# EAGLE design RedBoard_Turbo (EAGLE 9.1.1)
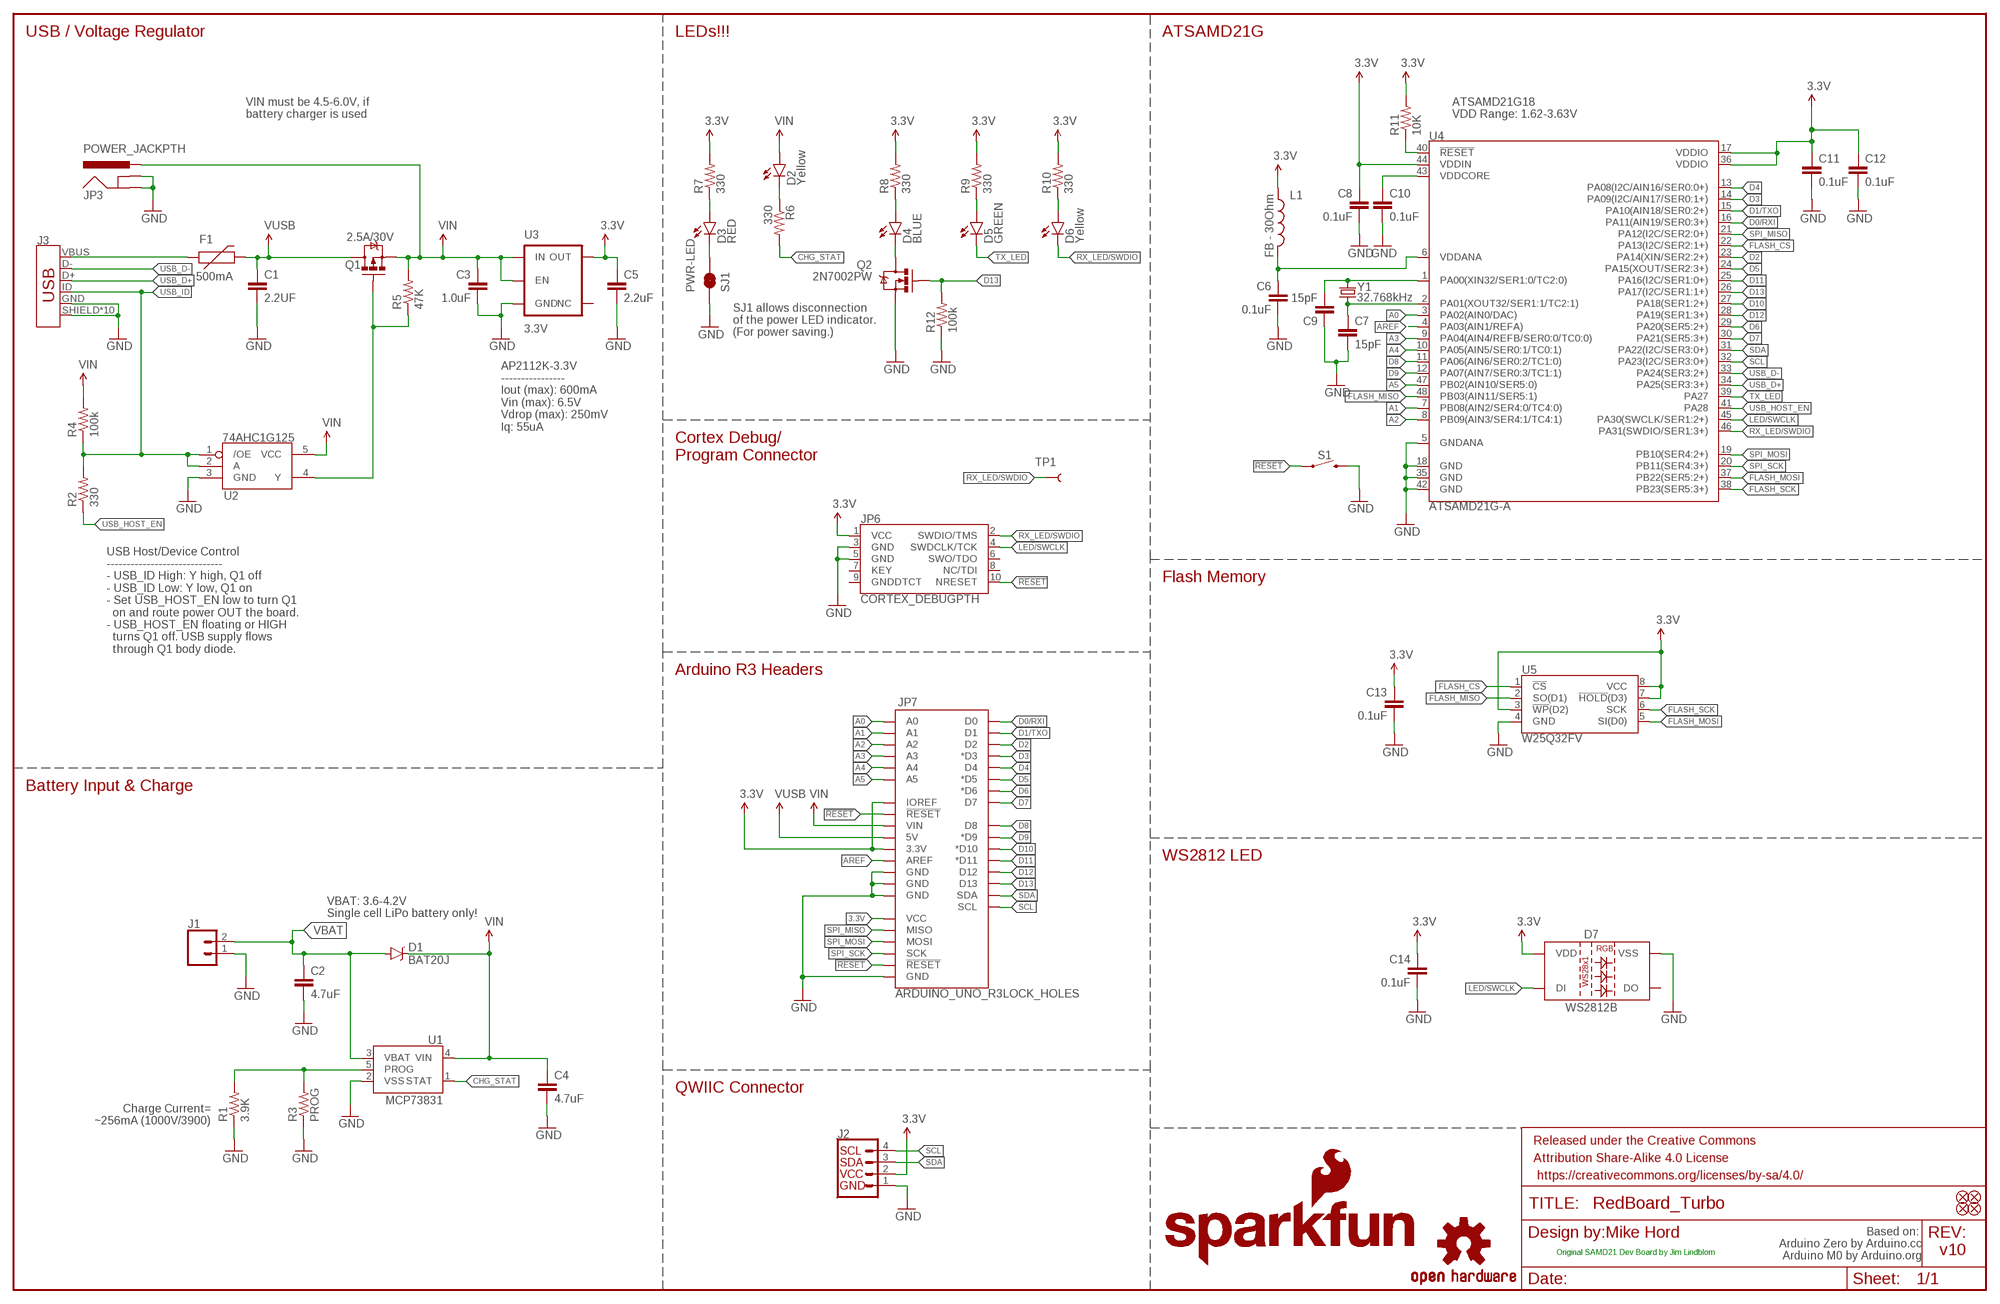
[diagram p0: schematic, sheet 1]

## Parts
C1  2.2UF  2.2UF50V10%(1206)  [1206@1]
C2  4.7uF  4.7UF-6.3V-10%(0603)0603  [0603-CAP]
C3  1.0uF  1.0UF-0805-25V-10%  [0805]
C4  4.7uF  4.7UF-6.3V-10%(0603)0603  [0603-CAP]
C5  2.2uF  2.2UF-10V-20%(0603)  [0603-CAP]
C6  0.1uF  0.1UF-25V(+80/-20%)(0603)  [0603-CAP]
C7  15pF  15PF-50V-5%(0603)  [0603-CAP]
C8  0.1uF  0.1UF-25V(+80/-20%)(0603)  [0603-CAP]
C9  15pF  15PF-50V-5%(0603)  [0603-CAP]
C10  0.1uF  0.1UF-25V(+80/-20%)(0603)  [0603-CAP]
C11  0.1uF  0.1UF-25V(+80/-20%)(0603)  [0603-CAP]
C12  0.1uF  0.1UF-25V(+80/-20%)(0603)  [0603-CAP]
C13  0.1uF  0.1UF-25V(+80/-20%)(0603)  [0603-CAP]
C14  0.1uF  0.1UF-25V(+80/-20%)(0603)  [0603-CAP]
D1  BAT20J  DIODE-SCHOTTKY-BAT20J  [SOD-323]
D2  Yellow  LED-YELLOW0603  [LED-0603]
D3  RED  LED-RED0603  [LED-0603]
D4  BLUE  LED-BLUE0603  [LED-0603]
D5  GREEN  LED-GREEN0603  [LED-0603]
D6  Yellow  LED-YELLOW0603  [LED-0603]
D7  WS2812B  [WS2812B]
F1  500mA  PTCSMD  [PTC-1206]
FID1  FIDUCIAL1X2  [FIDUCIAL-1X2]
FID2  FIDUCIAL1X2  [FIDUCIAL-1X2]
FID3  FIDUCIAL1X2  [FIDUCIAL-1X2]
FID4  FIDUCIAL1X2  [FIDUCIAL-1X2]
FRAME1  FRAME-LEDGER  [CREATIVE_COMMONS]
J1  CONN_02JST-PTH-2  [JST-2-PTH]
J2  QWIIC_CONNECTORJS-1MM  [1X04_1MM_RA]
J3  USB_MICRO-B_HALF_PTH_MILL  [USB-MICROB-PTH-MILL]
JP3  POWER_JACKPTH  [POWER_JACK_PTH]
JP6  CORTEX_DEBUGPTH  [2X5-PTH-1.27MM]
JP7  ARDUINO_UNO_R3LOCK_HOLES  [ARDUINO_R3_LOCK_HOLES]
L1  FB - 30Ohm  INDUCTOR0603  [0603]
LOGO1  SFE_LOGO_NAME_FLAME.2_INCH  [SFE_LOGO_NAME_FLAME_.2]
LOGO2  SFE_LOGO_NAME_FLAME.3_INCH  [SFE_LOGO_NAME_FLAME_.3]
LOGO3  OSHW-LOGOS  [OSHW-LOGO-S]
LOGO4  OSHW-LOGOL  [OSHW-LOGO-L]
Q1  2.5A/30V  MOSFET-PCHANNELDMG2307L  [SOT23-3]
Q2  2N7002PW  MOSFET-NCHANNEL2N7002PW  [SOT323]
R1  3.9K  3.9KOHM1/10W1%(0603)  [0603]
R2  330  330OHM1/10W1%(0603)  [0603-RES]
R3  PROG  RESISTORPTH-1/6W  [1/6W-RES]
R4  100k  100KOHM-1/10W-1%(0603)  [0603-RES]
R5  47K  47KOHM1/10W1%(0603)  [0603-RES]
R6  330  330OHM1/10W1%(0603)  [0603-RES]
R7  330  330OHM1/10W1%(0603)  [0603-RES]
R8  330  330OHM1/10W1%(0603)  [0603-RES]
R9  330  330OHM1/10W1%(0603)  [0603-RES]
R10  330  330OHM1/10W1%(0603)  [0603-RES]
R11  10K  10KOHM-1/10W-1%(0603)0603  [0603-RES]
R12  100k  100KOHM-1/10W-1%(0603)  [0603-RES]
S1  MOMENTARY-SWITCH-SPST-SMD-5.2-TALL-REDUNDANT  [TACTILE_SWITCH_SMD_5.2MM]
SJ1  PWR-LED  JUMPER-PAD-2-NC_BY_TRACENO_SILK  [PAD-JUMPER-2-NC_BY_TRACE_NO_SILK]
TP1  TEST-POINTTP_15TH_THRU  [TP_15TH]
U1  MCP73831  [SOT23-5]
U2  74AHC1G125  [SOT23-5]
U3  3.3V  V_REG_AP2112K-3.3V  [SOT23-5]
U4  ATSAMD21G-A  [TQFP-48]
U5  W25Q32FV  W25Q32FVSS  [SOIC-8]
Y1  32.768kHz  CRYSTAL3.2X1.5MM  [CRYSTAL-SMD-3.2X1.5MM]

## Nets
3.3V: C5.1 C8.1 C11.1 C12.1 C13.1 C14.1 D7.1(VDD) J2.2 JP6.1(VCC) JP7.3.3V JP7.IOREF JP7.VCC L1.1 R7.2 R8.2 R9.2 R10.2 R11.2 U3.5(OUT) U4.17(VDDIO) U4.36(VDDIO) U4.44(VDDIN) U5.3(!WP!(D2)) U5.7(!HOLD!(D3)) U5.8(VCC)
!RESET: JP6.10(NRESET) JP7.RESET@1(!RESET!) JP7.RESET@2(!RESET!) R11.1 S1.1 S1.2 U4.40(!RESET!)
A0: JP7.A0 U4.3(PA02(AIN0/DAC))
A1: JP7.A1 U4.7(PB08(AIN2/SER4:0/TC4:0))
A2: JP7.A2 U4.8(PB09(AIN3/SER4:1/TC4:1))
A3: JP7.A3 U4.9(PA04(AIN4/REFB/SER0:0/TC0:0))
A4: JP7.A4 U4.10(PA05(AIN5/SER0:1/TC0:1))
A5: JP7.A5 U4.47(PB02(AIN10/SER5:0))
AREF: JP7.AREF U4.4(PA03(AIN1/REFA))
CHG_STAT: R6.2 U1.1(STAT)
D0/RXI: JP7.D0 U4.16(PA11(AIN19/SER0:3+))
D1/TXO: JP7.D1 U4.15(PA10(AIN18/SER0:2+))
D2: JP7.D2 U4.23(PA14(XIN/SER2:2+))
D3: JP7.D3(*D3) U4.14(PA09(I2C/AIN17/SER0:1+))
D4: JP7.D4 U4.13(PA08(I2C/AIN16/SER0:0+))
D5: JP7.D5(*D5) U4.24(PA15(XOUT/SER2:3+))
D6: JP7.D6(*D6) U4.29(PA20(SER5:2+))
D7: JP7.D7 U4.30(PA21(SER5:3+))
D8: JP7.D8 U4.11(PA06(AIN6/SER0:2/TC1:0))
D9: JP7.D9(*D9) U4.12(PA07(AIN7/SER0:3/TC1:1))
D10: JP7.D10(*D10) U4.27(PA18(SER1:2+))
D11: JP7.D11(*D11) U4.25(PA16(I2C/SER1:0+))
D12: JP7.D12 U4.28(PA19(SER1:3+))
D13: JP7.D13 Q2.1(G) R12.2 U4.26(PA17(I2C/SER1:1+))
FLASH_CS: U4.22(PA13(I2C/SER2:1+)) U5.1(!CS!)
FLASH_MISO: U4.48(PB03(AIN11/SER5:1)) U5.2(SO(D1))
FLASH_MOSI: U4.37(PB22(SER5:2+)) U5.5(SI(D0))
FLASH_SCK: U4.38(PB23(SER5:3+)) U5.6(SCK)
GND: C1.2 C2.2 C3.2 C4.2 C5.2 C6.2 C7.2 C8.2 C9.1 C10.2 C11.2 C12.2 C13.2 C14.2 D7.3(VSS) J1.1 J2.1 J3.GND J3.SHIELD J3.SHIELD2(SHIELD) J3.SHIELD3(SHIELD) J3.SHIELD4(SHIELD) J3.SHIELD5(SHIELD) J3.SHIELD6(SHIELD) J3.SHIELD7(SHIELD) J3.SHIELD8(SHIELD) J3.SHIELD9(SHIELD) J3.SHIELD10(SHIELD) JP3.GND JP3.GNDBREAK JP6.3(GND) JP6.5(GND) JP7.GND@1(GND) JP7.GND@2(GND) JP7.GND@3(GND) JP7.GND@4(GND) Q2.2(S) R1.1 R3.1 R12.1 S1.3 S1.4 SJ1.1 U1.2(VSS) U2.3(GND) U3.2(GND) U4.5(GNDANA) U4.18(GND) U4.35(GND) U4.42(GND) U5.4(GND)
LED/SWCLK: D7.4(DI) JP6.4(SWDCLK/TCK) U4.45(PA30(SWCLK/SER1:2+))
N$1: F1.1 J3.VBUS
N$2: C9.2 U4.1(PA00(XIN32/SER1:0/TC2:0)) Y1.P$2
N$3: D4.C Q2.3(D)
N$4: C7.1 U4.2(PA01(XOUT32/SER1:1/TC2:1)) Y1.P$1
N$5: D3.A R7.1
N$6: D4.A R8.1
N$8: D2.C R6.1
N$10: D5.A R9.1
N$11: D6.A R10.1
N$12: D3.C SJ1.2
N$13: R1.2 R3.2 U1.5(PROG)
RX_LED/SWDIO: D6.C JP6.2(SWDIO/TMS) TP1.P$1 U4.46(PA31(SWDIO/SER1:3+))
SCL: J2.4 JP7.SCL U4.32(PA23(I2C/SER3:0+))
SDA: J2.3 JP7.SDA U4.31(PA22(I2C/SER3:0+))
SPI_MISO: JP7.MISO U4.21(PA12(I2C/SER2:0+))
SPI_MOSI: JP7.MOSI U4.19(PB10(SER4:2+))
SPI_SCK: JP7.SCK U4.20(PB11(SER4:3+))
TX_LED: D5.C U4.39(PA27)
USB_D+: J3.D+ U4.34(PA25(SER3:3+))
USB_D-: J3.D- U4.33(PA24(SER3:2+))
USB_HOST_EN: R2.1 U4.41(PA28)
USB_HOST_POWER_EN: Q1.1(G) R5.1 U2.4(Y)
USB_ID: J3.ID R2.2 R4.1 U2.1(/OE) U2.2(A)
VBAT: C2.1 D1.A J1.2 U1.3(VBAT)
VDDANA: C6.1 L1.2 U4.6(VDDANA)
VDDCORE: C10.1 U4.43(VDDCORE)
VIN: C3.1 C4.1 D1.C D2.A JP3.PWR JP7.VIN Q1.2(S) R4.2 R5.2 U1.4(VIN) U2.5(VCC) U3.1(IN) U3.3(EN)
VUSB: C1.1 F1.2 JP7.5V Q1.3(D)
Unconnected: D7.2(DO) JP6.6(SWO/TDO) JP6.7(KEY) JP6.8(NC/TDI) JP6.9(GNDDTCT) U3.4(NC)

## Notes on the sheet
- USB / Voltage Regulator | LEDs!!! | ATSAMD21G
- VIN must be 4.5-6.0V, if 
  battery charger is used
- ATSAMD21G18
  VDD Range: 1.62-3.63V
- SJ1 allows disconnection
  of the power LED indicator.
  (For power saving.)
- AP2112K-3.3V
  ----------------
  Iout (max): 600mA 
  Vin (max): 6.5V
  Vdrop (max): 250mV
  Iq: 55uA
- Cortex Debug/
  Program Connector
- USB Host/Device Control
  -----------------------------
  - USB_ID High: Y high, Q1 off
  - USB_ID Low: Y low, Q1 on
  - Set USB_HOST_EN low to turn Q1
    on and route power OUT the board.
  - USB_HOST_EN floating or HIGH
    turns Q1 off. USB supply flows
    through Q1 body diode.
- Flash Memory
- Arduino R3 Headers
- Battery Input & Charge
- WS2812 LED
- VBAT: 3.6-4.2V
  Single cell LiPo battery only\!
- QWIIC Connector
- Charge Current=
  ~256mA (1000V/3900)
- Mike Hord
- Based on: 
  Arduino Zero by Arduino.cc
  Arduino M0 by Arduino.org
- v10
- Original SAMD21 Dev Board by Jim Lindblom

## Library data of the parts
C1 = SparkFun-Capacitors:2.2UF50V10%(1206): CAP-10009; PROD_ID: CAP-10009
C2 C4 = SparkFun-Capacitors:4.7UF-6.3V-10%(0603): CAP-08280; PROD_ID: CAP-08280
C3 = SparkFun-Capacitors:1.0UF: 1µF ceramic capacitors A capacitor is a passive two-terminal electrical component used to store electrical energy temporarily in an electric field.; PROD_ID: CAP-08064
C5 = SparkFun-Capacitors:2.2UF-10V-20%(0603): CAP-07888; PROD_ID: CAP-07888
C6 C8 C10-C14 = SparkFun-Capacitors:0.1UF-25V(+80/-20%)(0603): CAP-00810 Ceramic Standard decoupling cap; PROD_ID: CAP-00810
C7 C9 = SparkFun-Capacitors:15PF-50V-5%(0603): CAP-07881; PROD_ID: CAP-07881
D1 = SparkFun-DiscreteSemi:DIODE-SCHOTTKY: Schottky diodes in SFE's production catalog BAT20J 1A 23V 0.62Vf RB751 120mA 40V 0.37Vf PMEG4005EJ 0.5A 40V 0.42Vf MBRA140 1A 40V 0.5Vf B340A 3A 40V SMA; PROD_ID: DIO-11623
D2 D6 = SparkFun-LED:LED-YELLOW: Yellow SMD LED Used in manufacturing several products at SparkFun. Packages: 0603 - SMD 0603 package[Product Link] <http://www.kingbrightusa.com/product.asp?catalog_name=LED&product_id=APT1608SYCK> 0603 -SMART - SMART SMD 0603 package (more efficient/more expensive) [Product Link] <http://www.osram-os.com/osram_os/en/products/product-catalog/led-light-emitting-diodes/smartled-0603/ly-l29k/index.jsp> LilyPad - SMD1206 package[Product Datasheet] <https://www.sparkfun.com/datasheets/DevTools/LilyPad/Q150YUS4.pdf> SparkFun Products: Blynk Board <https://www.sparkfun.com/products/13794> IOIO-OTG <https://www.sparkfun.com/products/13613> XBee Explorer Serial <https://www.sparkfun.com/products/13225>; PROD_ID: DIO-09003
D3 = SparkFun-LED:LED-RED: Red SMD LED Used in manufacturing of most products at SparkFun Packages: 0603 - SMD 0603 package [Product Link] <http://docs.avagotech.com/docs/AV02-0551EN> 0603 SMART - SMD 0603 SMART package ( more efficient and expensive)[Product Link] <http://www.osram-os.com/Graphics/XPic2/00077099_0.pdf> 1206 - SMD1206 package [Product Link] <https://www.sparkfun.com/datasheets/DevTools/LilyPad/Q150OVS4.pdff> SparkFun Products: Pro Mini 328 -5V <https://www.sparkfun.com/products/821> RedBoard <https://www.sparkfun.com/products/12757> IOIO-OTG <https://www.sparkfun.com/products/13613>; PROD_ID: DIO-00819
D4 = SparkFun-LED:LED-BLUE: Blue SMD LED Used in manufacturing of various products at SparkFun Packages: 0603 - SMD 0603 package [Product Link] <http://www.digikey.com/product-detail/en/SMLE12BC7TT86/511-1589-2-ND/1641808> 1206 - SMD1206 package [Product Link] <http://www.digikey.com/product-detail/en/lite-on-inc/LTST-C150TBKT/160-1643-1-ND/573584> SparkFun Products: ESP8266 Thing-Dev Board <https://www.sparkfun.com/products/13711> RedBoard <https://www.sparkfun.com/products/12757>; PROD_ID: DIO-08575
D5 = SparkFun-LED:LED-GREEN: Green SMD LED Used in manufacturing of various products at SparkFun Packages: 0603 - SMD 0603 package [Product Link] <http://www.futureelectronics.com/en/technologies/semiconductors/optoelectronics/leds/Pages/9894312-LTST-C190GKT.aspx?CrossPart=HSMG-C190&IM=0> LilyPad 1206 - SMD1206 LilyPad package [Product Link] <http://www.futureelectronics.com/en/Technologies/Product.aspx?ProductID=IN150NGHARVATEKCORPORATION2049943&IM=0> 1206 - SMD1206 package [Product Link] <http://www.futureelectronics.com/en/technologies/semiconductors/optoelectronics/leds/Pages/8315665-LTST-C150KGKT.aspx?IM=0> 1206 Bottom Mount -SMD 1206 Bottom Mount [Product Link] <http://www.digikey.com/product-detail/en/lite-on-inc/LTST-C230KGKT/160-1456-1-ND/386854> SparkFun Products: Pro Mini 328 -5V <https://www.sparkfun.com/products/821> RedBoard <https://www.sparkfun.com/products/12757> MP3 Trigger <https://www.sparkfun.com/products/13720> Makey Makey <https://www.sparkfun.com/products/11076>; PROD_ID: DIO-00821
D7 = SparkFun-LED:WS2812B: WS2812B SMD addressable RGB LED 5x5mm SMD LED with built-in controller IC. Color: Red/Green/Blue mC Rating: RGB: 390, 660, 180 mcd Forward Voltage: RGB: 2.0, 3.0, 3.0 V Packages:WS2812B SparkFun Products: Blynk Board - ESP8266 <https://www.sparkfun.com/products/13794>; PROD_ID: DIO-12503
F1 = SparkFun-PowerIC:PTC: Resettable Fuse PTC Resettable Fuse. Spark Fun Electronics SKU : COM-08357; PROD_ID: RES-11150
FID1-FID4 = SparkFun-Aesthetics:FIDUCIAL: Fiducial Alignment Points Various fiducial points for machine vision alignment.
FRAME1 = SparkFun-Aesthetics:FRAME-LEDGER: Schematic Frame Standard 11x14 US Ledger frame
J1 = SparkFun-Connectors:CONN_02: Multi connection point. Often used as Generic Header-pin footprint for 0.1 inch spaced/style header connections On any of the 0.1 inch spaced packages, you can populate with these: Break Away Headers - Straight <https://www.sparkfun.com/products/116> (PRT-00116) Break Away Male Headers - Right Angle <https://www.sparkfun.com/products/553> (PRT-00553) Female Headers <https://www.sparkfun.com/products/115> (PRT-00115) Break Away Headers - Machine Pin <https://www.sparkfun.com/products/117> (PRT-00117) Break Away Female Headers - Swiss Machine Pin <https://www.sparkfun.com/products/743> (PRT-00743) For SCREWTERMINALS and SPRING TERMINALS visit here: Screw Terimnals on SparkFun.com <https://www.sparkfun.com/search/results?term=Screw+Terminals> (5mm/3.5mm/2.54mm spacing) This device is also useful as a general connection point to wire up your design to another part of your project. Our various solder wires solder well into these plated through hole pads. Hook-Up Wire - Assortment (Stranded, 22 AWG) <https://www.sparkfun.com/products/11375> (PRT-11375) Hook-Up Wire - Assortment (Solid Core, 22 AWG) <https://www.sparkfun.com/products/11367> (PRT-11367) View the entire wire category on our website here <https://www.sparkfun.com/categories/141> Special notes: Molex polarized connector foot print use with: PRT-08233 with associated crimp pins and housings. 2.54_SCREWTERM for use with PRT-10571. 3.5mm Screw Terminal footprints for PRT-08084 5mm Screw Terminal footprints for use with PRT-08432; PROD_ID: CONN-09863; SKU: PRT-09914
J2 = SparkFun-Connectors:QWIIC_CONNECTOR: SparkFun I2C Standard Qwiic Connector An SMD 1mm pitch JST connector makes it easy and quick (get it? Qwiic?) to connect I2C devices to each other. The Qwiic system <http://www.sparkfun.com/qwiic> enables fast and solderless connection between popular platforms and various sensors and actuators. We carry 200mm <https://www.sparkfun.com/products/14204>, 100mm <https://www.sparkfun.com/products/14205>, 50mm <https://www.sparkfun.com/products/14206>, and breadboard friendly <https://www.sparkfun.com/products/14207> Qwiic cables. We also offer 10 pcs strips <https://www.sparkfun.com/products/14323> the SMD connectors.; PROD_ID: CONN-13694
J3 = SparkFun-Connectors:USB_MICRO-B: USB Type Micro-B Connector Male/female and PTH/SMT variants SparkFun Products: SparkFun microB USB Breakout <https://www.sparkfun.com/products/12035> SparkFun USB microB Plug Breakout <https://www.sparkfun.com/products/10031> SparkFun ESP8266 Thing <https://www.sparkfun.com/products/13231>; PROD_ID: CONN-13711
JP3 = SparkFun-Connectors:POWER_JACK: Power Jack This is the standard 5.5mm barrel jack for power. The PTH is the most common, proven, reliable, footprint. The Slot footprint only works if the mill layer is transmitted to the PCB fab house so be warned. Mating wall wart : TOL-00298 (and others); PROD_ID: CONN-08197
JP6 = samd21-temp:CORTEX_DEBUG: Cortex Debug Connector Datasheet <http://infocenter.arm.com/help/topic/com.arm.doc.faqs/attached/13634/cortex_debug_connectors.pdf>
JP7 = SparkFun-Boards:ARDUINO_UNO_R3: Arduino R3 Footprint with SPI header Arduino Uno R3 Compatible Footprint. Matches PCB size of the original board. SparkFun Products: SAMD21 Dev Breakout <https://www.sparkfun.com/products/13672> RedBoard <https://www.sparkfun.com/products/12757> R3 Stackable Headers <https://www.sparkfun.com/products/11417>
L1 = SparkFun-Passives:INDUCTOR: Inductors Basic Inductor/Choke - 0603 and 1206. Footprints are not proven and vary greatly between part numbers. INDUCTOR POWER 3.3UH 4.0A SMD 0.197" L x 0.197" W x 0.177" H (5.00mm x 5.00mm x 4.50mm); PROD_ID: NDUC-07859
LOGO1 LOGO2 = SparkFun-Aesthetics:SFE_LOGO_NAME_FLAME: SparkFun Font Logo w/ Flame This is the SparkFun full logo. The logo on the schematic will always be the same size; the package variant is the height of the flame part of the logo. Default layer for the logo on the board is tSilk.
LOGO3 LOGO4 = SparkFun-Aesthetics:OSHW-LOGO: Open Source Hardware Logo This logo indicates the piece of hardware it is found on incorporates a OSHW license and/or adheres to the definition of open source hardware found here: http://freedomdefined.org/OSHW
Q1 = SparkFun-DiscreteSemi:MOSFET-PCHANNEL: Generic PMOSFET IRLML2244 - TRANS-11153 (SOT-23 -20V -4.3A) (1.Gate 2.Source 3.Drain) FQP27P06 - COM-10349 <http://www.sparkfun.com/products/10349> (TO-220 -60V -27A) (1.Gate 2.Source 3.Drain); PROD_ID: TRANS-11308
Q2 = SparkFun-DiscreteSemi:MOSFET-NCHANNEL: Common NMOSFET Parts MFG P/N Store ID Prod ID FDD8780 TRANS-09984 SI7820DN TRANS-11055 FDS6630A IC-08089 2N7002PW TRANS-11151 FQP30N06L COM-10213 TRANS-10060 BSS123LT1G TRANS-08345 BSS138 TRANS-00830 BS170 2N7000; PROD_ID: TRANS-11151
R1 = SparkFun-Resistors:3.9KOHM1/10W1%(0603): RES-08701; PROD_ID: RES-08701
R2 R6-R10 = SparkFun-Resistors:330OHM1/10W1%(0603): RES-00818; PROD_ID: RES-00818
R3 = SparkFun-Passives:RESISTOR: Resistor Basic schematic elements and footprints for 0603, 1206, and PTH resistors.
R4 R12 = SparkFun-Resistors:100KOHM-1/10W-1%(0603): RES-07828; PROD_ID: RES-07828
R5 = SparkFun-Resistors:47KOHM1/10W1%(0603): RES-07871; PROD_ID: RES-07871
R11 = SparkFun-Resistors:10KOHM-1/10W-1%(0603): RES-00824; PROD_ID: RES-00824
S1 = SparkFun-Switches:MOMENTARY-SWITCH-SPST: Momentary Switch (Pushbutton) - SPST Normally-open (NO) SPST momentary switches (buttons, pushbuttons). Variants PTH-12MM - 12mm square, through-hole Momentary Pushbutton Switch - 12mm Square <https://www.sparkfun.com/products/9190> (COM-09190) PTH-6.0MM, PTH-6.0MM-KIT - 6.0mm square, through-hole Mini Pushbutton Switch <https://www.sparkfun.com/products/97> (COM-00097) KIT package intended for soldering kit's - only one side of pads' copper is exposed. PTH-RIGHT-ANGLE-KIT - Right-angle, through-hole Right Angle Tactile Button <https://www.sparkfun.com/products/10791> - Used on SparkFun BigTime Watch Kit <https://www.sparkfun.com/products/11734> SMD-12MM - 12mm square, surface-mount Tactile Button - SMD (12mm) <https://www.sparkfun.com/products/12993> (COM-12993) Used on SparkFun PicoBoard <https://www.sparkfun.com/products/11888> SMD-4.5MM - 4.5mm Square Trackball Switch Used on SparkFun Blackberry Trackballer Breakout <https://www.sparkfun.com/products/13169> SMD-4.6MMX2.8MM - 4.60mm x 2.80mm, surface mount Used on SparkFun SAMD21 Mini Breakout <https://www.sparkfun.com/products/13664> SMD-5.2MM, SMD-5.2-REDUNDANT - 5.2mm square, surface-mount Mini Pushbutton Switch - SMD <https://www.sparkfun.com/products/8720> (COM-08720) Used on Arduino Pro Mini <https://www.sparkfun.com/products/11114> REDUNDANT package connects both switch circuits together SMD-6.0X3.5MM - 6.0 x 3.5mm, surface mount Momentary Reset Switch SMD <https://www.sparkfun.com/products/8229> (COM-08229) SMD-6.2MM-TALL - 6.2mm square, surface mount Tactile Button - SMD (6mm) <https://www.sparkfun.com/products/12992> Used on SparkFun Digital Sandbox <https://www.sparkfun.com/products/12651> SMD-RIGHT-ANGLE - Right-angle, surface mount Used on SparkFun Block for Intel® Edison - Arduino <https://www.sparkfun.com/products/13036>; PROD_ID: SWCH-14139
SJ1 = SparkFun-Passives:JUMPER-PAD-2-NC_BY_TRACE
TP1 = SparkFun-Connectors:TEST-POINT: SparkFun Test Points Bare copper test points for troubleshooting or In-Circuit-Testing. These are used by our Production team for verifying production board runs using pogo-pins on test beds. SparkFun Products: SparkFun LSM9DS1 Breakout <https://www.sparkfun.com/products/13284> SparkFun PSOC <https://www.sparkfun.com/products/13714> SparkFun Load Cell Amplifier <https://www.sparkfun.com/products/13879>
U1 = SparkFun-PowerIC:MCP73831: Miniature single cell, fully integrated Li-Ion, Li-polymer charge management controller http://ww1.microchip.com/downloads/en/DeviceDoc/20001984g.pdf IC-09995; PROD_ID: IC-09995
U2 = SparkFun-DigitalIC:74AHC1G125: Single bus buffer gate with 3-state output; PROD_ID: IC-11920
U3 = SparkFun-PowerIC:V_REG_AP2112: AP2112 - 600mA CMOS LDO Regulator w/ Enable The AP2112 is CMOS process low dropout linear regulator with enable function, the regulator delivers a guaranteed 600mA (min.) continuous load current. Features Output Voltage Accuracy: ±1.5% Output Current: 600mA (Min.) Foldback Short Current Protection: 50mA Enable Function to Turn ON/OFF VOUT Low Dropout Voltage (3.3V): 250mV (Typ.) @IOUT=600mA Excellent Load Regulation: 0.2%/A (Typ.) Excellent Line Regulation: 0.02%/V (Typ.) Low Quiescent Current: 55μA (Typ.) Low Standby Current: 0.01μA (Typ.) Low Output Noise: 50μVRMS PSRR: 100Hz -65dB, 1kHz -65dB OTSD Protection Stable with 1.0μF Flexible Cap: Ceramic, Tantalum and Aluminum Electrolytic Operation Temperature Range: -40°C to 85°C ESD: MM 400V, HBM 4000V; PROD_ID: VREG-12457
U4 = samd21-temp:ATSAMD21G: Atmel SAMD21G SMART ARM-Based Microcontroller The Atmel ® | SMART ™ SAM D21 is a series of low-power microcontrollers using the 32-bit ARM ® Cortex ® -M0+ processor, and ranging from 32- to 64-pins with up to 256KB Flash and 32KB of SRAM. The SAM D21 devices operate at a maximum frequency of 48MHz and reach 2.46 CoreMark/MHz. They are designed for simple and intuitive migration with identical peripheral modules, hex compatible code, identical linear address map and pin compatible migration paths between all devices in the product series. All devices include intelligent and flexible peripherals, Atmel Event System for inter-peripheral signaling, and support for capacitive touch button, slider and wheel user interfaces.; PROD_ID: IC-13064
U5 = SparkFun-IC-Memory:W25Q32FV: W25Q32FV 32Mb (4MB) Serial Flash Memory The W25Q32FV support the standard Serial Peripheral Interface (SPI), Dual/Quad I/O SPI as well as 2-clocks instruction cycle Quad Peripheral Interface (QPI). 104MHz, SPI, 8-SOIC-EIAJ Datasheet <http://www.winbond.com/resource-files/w25q32fv%20revh%20091613.pdf> SparkFun Products SparkFun Blynk Board - ESP8266 <https://www.sparkfun.com/products/13794> (WRL-13794); PROD_ID: IC-13229
Y1 = samd21-temp:CRYSTAL: Various standard crystals. Proven footprints.; PROD_ID: XTAL-13062

## Board
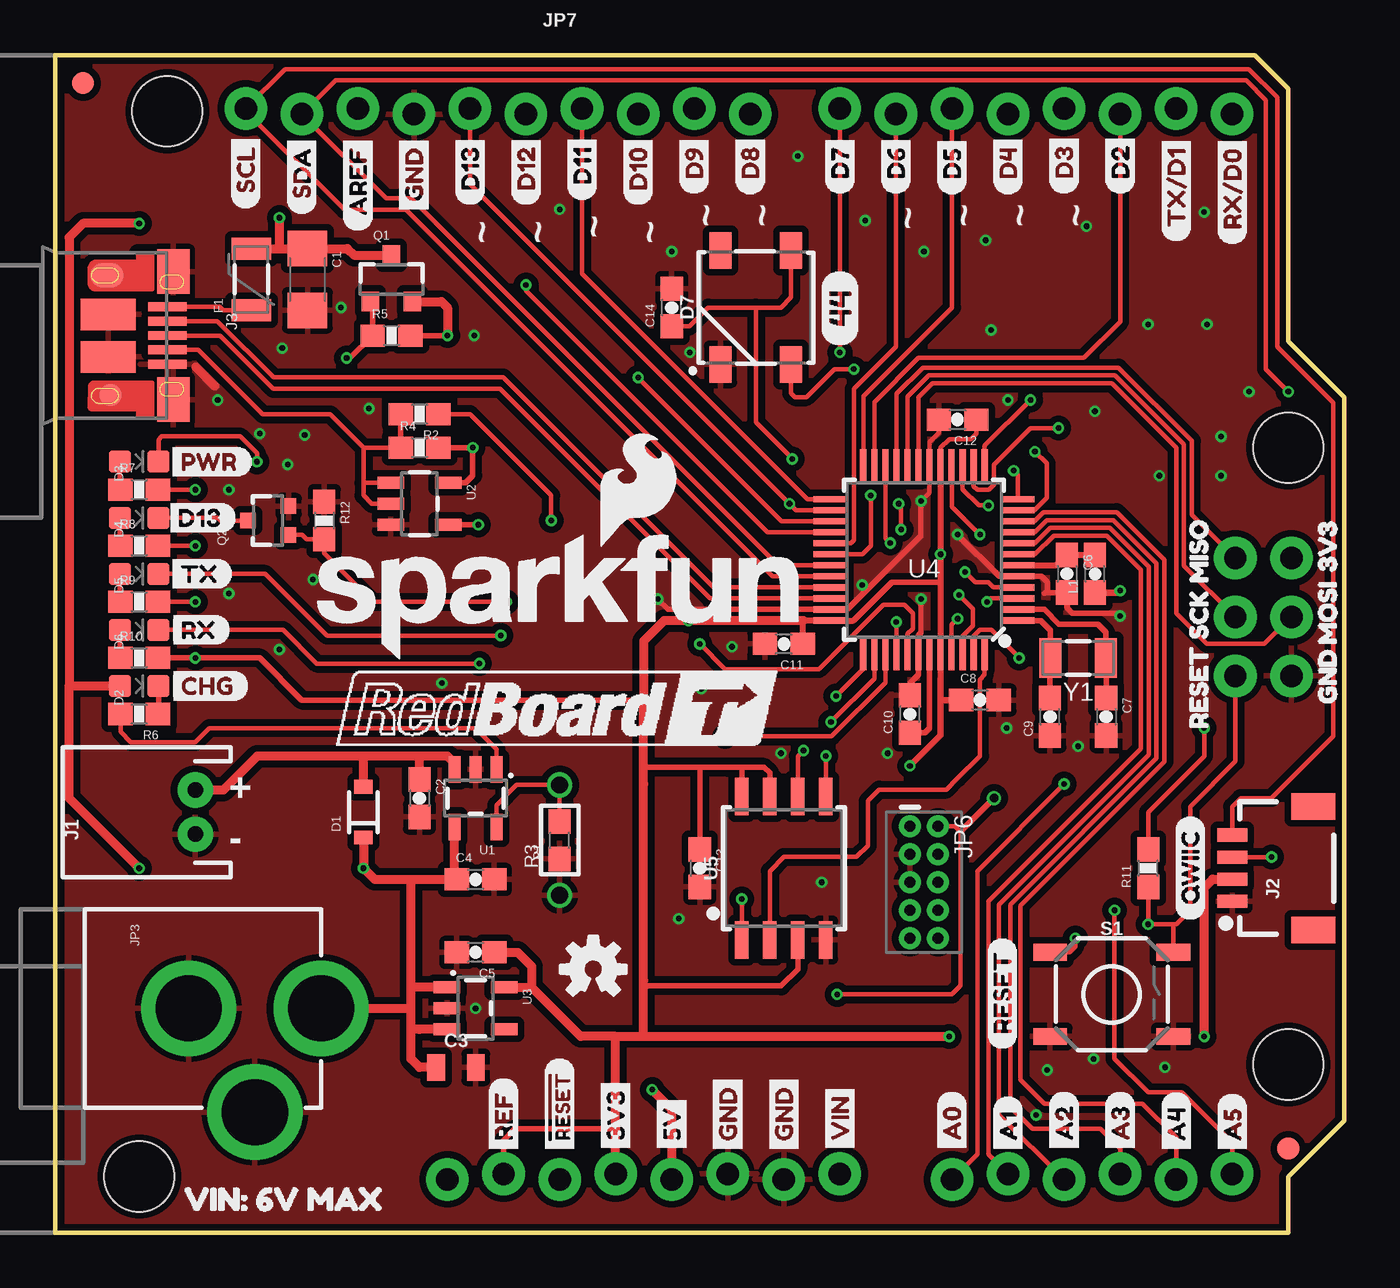
[diagram p1: board, top side]
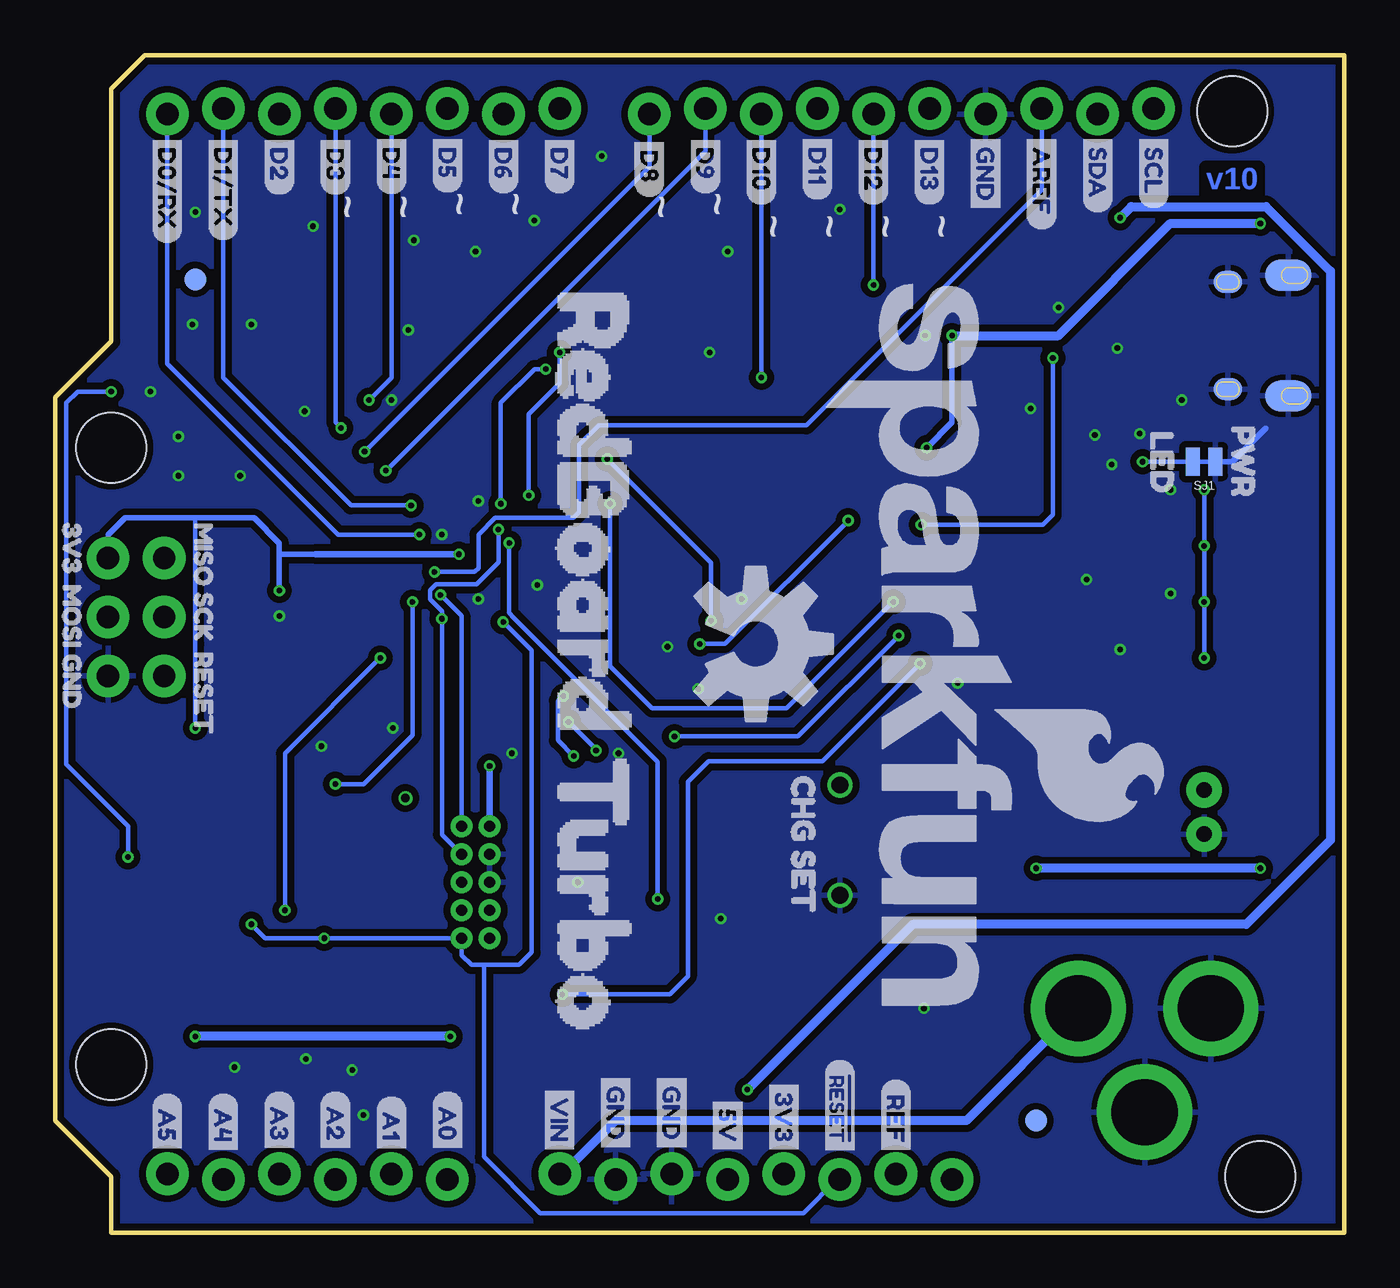
[diagram p2: board, bottom side, seen from below]

Size 58.42 x 53.34 mm. Coordinates in mm from the lower left corner, seen from the top.
Outline: 0,53.34 0,0 55.88,0 55.88,2.54 58.42,5.08 58.42,37.85 55.88,40.39 55.88,51.82 54.36,53.34 0,53.34
Copper layers (1*16): Top 0.035mm / dielectric 1.5mm / Bottom 0.035mm
Design rules "Gold_Phoenix_Standard_Spec_2_layer": minimum track width 5mil, minimum drill 6mil, track to track 5mil, track to pad 5mil, pad to pad 5mil, via to via 5mil, smd to smd 5mil, copper to edge 8mil, drill to drill 8mil, minimum pad ring 5mil, minimum via ring 5mil, stop-mask expansion 4mil, vias tented up to drill 20mil, thermal gap 10mil

### Footprints (pad centres in the part's own frame; a part is rotated, then mirrored left to right if it is on the bottom)
1206@1 = smd 1.6 x 1.8: 1 -1.4,0; 2 1.4,0
0603-CAP = smd 1.1 x 1: 1 -0.85,0; 2 0.85,0
0805 = smd 0.8 x 1.2: 1 -0.9,0; 2 0.9,0
SOD-323 = smd 0.63 x 0.83: A 1.15,0; C -1.15,0
LED-0603 = smd 1 x 1: A -0.877,0; C 0.877,0
WS2812B = smd 1.651 x 1: 1 2.577,-1.6; 2 2.577,1.6; 3 -2.577,1.6; 4 -2.577,-1.6
PTC-1206 = smd 1 x 1.8: 1 -1.4,0; 2 1.4,0
FIDUCIAL-1X2 = smd 1 x 1: 1 0,0
JST-2-PTH = drill 0.7 pad 1.6: 1 -1,0; 2 1,0
1X04_1MM_RA = smd 0.6 x 1.35: 1 -1.5,0; 2 -0.5,0; 3 0.5,0; 4 1.5,0 | smd 1.2 x 2: NC1 2.8,-3.675; NC2 -2.8,-3.675
USB-MICROB-PTH-MILL = smd 0.4 x 1.75: D+ 0,0; D- -0.65,0; GND 1.3,0; ID 0.65,0; VBUS -1.3,0 | smd 2 x 1.46: SHIELD -2.9,0.275; SHIELD2 2.9,0.275 | smd 1.425 x 2.5: SHIELD3 -0.963,-2.675; SHIELD4 0.963,-2.675 | smd 1.4 x 2.1 bottom: SHIELD5 -2.731,-2.531; SHIELD7 2.729,-2.531 | smd 1 x 1: SHIELD6 2.7,-2.575 | smd 1.1 x 1.5: SHIELD8 -2.731,-2.731 | smd 1 x 1.3 bottom: SHIELD9 -2.43,0.195; SHIELD10 2.43,0.195
POWER_JACK_PTH = drill 2.997 pad 4.318: GND 0,7.7; GNDBREAK 4.7,10.7; PWR 0,13.7
2X5-PTH-1.27MM = drill 0.508 pad 1: 1 -2.54,-0.635; 2 -2.54,0.635; 3 -1.27,-0.635; 4 -1.27,0.635; 5 0,-0.635; 6 0,0.635; 7 1.27,-0.635; 8 1.27,0.635; 9 2.54,-0.635; 10 2.54,0.635
ARDUINO_R3_LOCK_HOLES = drill 1.016 pad 1.93: 3.3V 35.56,2.667; 5V 38.1,2.413; A0 50.8,2.413; A1 53.34,2.667; A2 55.88,2.413; A3 58.42,2.667; A4 60.96,2.413; A5 63.5,2.667; AREF 23.876,50.927; D0 63.5,50.673; D1 60.96,50.927; D2 58.42,50.673; D3 55.88,50.927; D4 53.34,50.673; D5 50.8,50.927; D6 48.26,50.673; D7 45.72,50.927; D8 41.656,50.673; D9 39.116,50.927; D10 36.576,50.673; D11 34.036,50.927; D12 31.496,50.673; D13 28.956,50.927; GND@1 40.64,2.667; GND@2 43.18,2.413; GND@3 26.416,50.673; GND@4 66.18,25.223; IOREF 30.48,2.667; MISO 63.64,30.557; MOSI 66.18,27.89; NC 27.94,2.413; RESET@1 33.02,2.413; RESET@2 63.64,25.223; SCK 63.64,27.89; SCL 18.796,50.927; SDA 21.336,50.673; VCC 66.18,30.557; VIN 45.72,2.667 | hole 3.175: 15.24,50.8; 66.04,35.56; 66.04,7.62; 13.97,2.54
0603 = smd 1.1 x 1: 1 -0.85,0; 2 0.85,0
SOT23-3 = smd 0.8 x 0.9: 1 -0.95,-1; 2 0.95,-1; 3 0,1.1
SOT323 = smd 0.7 x 0.7: 1 -0.65,-0.925; 2 0.65,-0.925; 3 0,0.925
0603-RES = smd 1.1 x 1: 1 -0.85,0; 2 0.85,0
1/6W-RES = drill 0.762: 1 -2.5,0; 2 2.5,0
TACTILE_SWITCH_SMD_5.2MM = smd 1.524 x 0.762: 1 -2.794,1.905; 2 2.794,1.905; 3 -2.794,-1.905; 4 2.794,-1.905
PAD-JUMPER-2-NC_BY_TRACE_NO_SILK = smd 0.635 x 1.27: 1 -0.508,0; 2 0.508,0
TP_15TH = drill 0.381 pad 0.61: P$1 0,0
SOT23-5 = smd 0.55 x 1.2: 1 -0.95,-1.3; 2 0,-1.3; 3 0.95,-1.3; 4 0.95,1.3; 5 -0.95,1.3
TQFP-48 = smd 1.5 x 0.28: 1 -4.25,2.75; 2 -4.25,2.25; 3 -4.25,1.75; 4 -4.25,1.25; 5 -4.25,0.75; 6 -4.25,0.25; 7 -4.25,-0.25; 8 -4.25,-0.75; 9 -4.25,-1.25; 10 -4.25,-1.75; 11 -4.25,-2.25; 12 -4.25,-2.75; 25 4.25,-2.75; 26 4.25,-2.25; 27 4.25,-1.75; 28 4.25,-1.25; 29 4.25,-0.75; 30 4.25,-0.25; 31 4.25,0.25; 32 4.25,0.75; 33 4.25,1.25; 34 4.25,1.75; 35 4.25,2.25; 36 4.25,2.75 | smd 0.28 x 1.5: 13 -2.75,-4.25; 14 -2.25,-4.25; 15 -1.75,-4.25; 16 -1.25,-4.25; 17 -0.75,-4.25; 18 -0.25,-4.25; 19 0.25,-4.25; 20 0.75,-4.25; 21 1.25,-4.25; 22 1.75,-4.25; 23 2.25,-4.25; 24 2.75,-4.25; 37 2.75,4.25; 38 2.25,4.25; 39 1.75,4.25; 40 1.25,4.25; 41 0.75,4.25; 42 0.25,4.25; 43 -0.25,4.25; 44 -0.75,4.25; 45 -1.25,4.25; 46 -1.75,4.25; 47 -2.25,4.25; 48 -2.75,4.25
SOIC-8 = smd 0.61 x 1.702: 1 -1.905,-3.251; 2 -0.635,-3.251; 3 0.635,-3.251; 4 1.905,-3.251; 5 1.905,3.251; 6 0.635,3.251; 7 -0.635,3.251; 8 -1.905,3.251
CRYSTAL-SMD-3.2X1.5MM = smd 1 x 1.8: P$1 -1.25,0; P$2 1.25,0

### Placement (x,y rotation side)
C1  11.43,43.18 270 top
C2  16.51,19.68 270 top
C3  18.16,7.49 0 top
C4  19.05,16 0 top
C5  19.05,12.7 180 top
C6  45.85,29.84 270 top
C7  47.62,23.37 270 top
C8  41.91,24.13 0 top
C9  45.09,23.37 90 top
C10  38.73,23.5 90 top
C11  33.02,26.67 180 top
C12  40.89,36.83 180 top
C13  29.21,16.51 270 top
C14  27.94,41.91 90 top
D1  13.97,19.05 90 top
D2  3.81,24.77 0 top
D3  3.81,34.92 0 top
D4  3.81,32.38 0 top
D5  3.81,29.84 0 top
D6  3.81,27.3 0 top
D7  31.75,41.91 90 top
F1  8.89,43.18 90 top
FID1  1.27,52.07 0 top
FID2  55.88,3.81 0 top
FID3  13.97,5.08 0 bottom
FID4  52.07,43.18 0 bottom
FRAME1  3.81,-29.21 0 top  (outside the outline)
J1  6.35,19.05 90 top
J2  53.34,16.51 90 top
J3  5.08,40.64 270 top
JP3  -1.65,10.16 270 top
JP6  39.37,15.88 270 top
JP7  -10.16,0 0 top
L1  47.12,29.84 90 top
LOGO1  22.86,28.83 0 top
LOGO2  19.3,26.67 270 bottom
LOGO3  24.38,11.94 0 top
LOGO4  26.67,26.67 270 bottom
Q1  15.24,43.18 0 top
Q2  9.65,32.26 90 top
R1  22.86,17.78 90 top
R2  16.51,37.08 180 top
R3  22.86,17.78 90 top
R4  16.51,35.56 0 top
R5  15.24,40.64 0 top
R6  3.81,23.5 180 top
R7  3.81,33.66 0 top
R8  3.81,31.11 0 top
R9  3.81,28.57 0 top
R10  3.81,26.04 0 top
R11  49.53,16.51 90 top
R12  12.19,32.26 270 top
S1  47.88,10.79 0 top
SJ1  6.35,34.92 180 bottom
TP1  42.55,19.68 0 top
U1  19.05,19.68 180 top
U2  16.51,33.02 270 top
U3  19.05,10.16 270 top
U4  39.37,30.48 180 top
U5  33.02,16.51 0 top
U$1  [#RESET1]  22.86,3.3 90 top
U$2  [3V317]  25.4,3.43 90 top
U$3  [5V18]  27.94,3.43 90 top
U$4  [CHG30]  4.95,24.77 0 top
U$5  [RX#D015]  53.34,44.7 90 top
U$6  [TX#D114]  50.8,44.83 90 top
U$7  [D213]  48.26,46.99 90 top
U$8  [D312]  45.72,46.99 90 top
U$9  [D411]  43.18,46.99 90 top
U$10  [D510]  40.64,46.99 90 top
U$11  [D69]  38.1,46.99 90 top
U$12  [D78]  35.56,46.99 90 top
U$13  [D87]  31.5,46.99 90 top
U$14  [D96]  28.96,46.99 90 top
U$15  [D105]  26.42,46.48 90 top
U$16  [D114]  23.88,46.74 90 top
U$17  [D123]  21.34,46.48 90 top
U$18  [D132]  18.8,46.48 90 top
U$19  [GND16]  16.26,45.97 90 top
U$20  [SDA1]  11.18,46.1 90 top
U$21  [SCL0]  8.64,46.35 90 top
U$22  [TX28]  4.95,29.84 0 top
U$23  [RX29]  4.95,27.3 0 top
U$24  [PWR26]  4.95,34.92 0 top
U$25  [D1327]  4.83,32.38 0 top
U$26  [REF0]  20.32,3.43 90 top
U$27  [AREF2]  13.72,45.34 90 top
U$28  [QWIIC31]  51.44,14.1 90 top
U$29  [A020]  40.64,3.43 90 top
U$30  [A121]  43.18,3.43 90 top
U$31  [A222]  45.72,3.43 90 top
U$32  [A323]  48.26,3.43 90 top
U$33  [A424]  50.8,3.43 90 top
U$34  [A525]  53.34,3.43 90 top
U$35  [VIN19]  35.56,3.43 90 top
U$36  [GND16]  33.02,3.43 90 top
U$37  [GND16]  30.48,3.43 90 top
U$38  [GND7]  57.66,23.24 90 top
U$39  [MOSI4]  57.66,25.91 90 top
U$40  [3V36]  57.66,29.21 90 top
U$41  [SCK5]  51.82,26.16 90 top
U$42  [MISO3]  51.82,28.7 90 top
U$43  [RESET0]  51.82,22.1 90 top
U$44  [#RESET1]  22.86,8 270 bottom
U$45  [3V325]  25.4,7.11 270 bottom
U$46  [3V30]  57.66,32.89 270 bottom
U$47  [A018]  40.64,6.48 270 bottom
U$48  [A119]  43.18,6.22 270 bottom
U$49  [A220]  45.72,6.48 270 bottom
U$50  [A321]  48.26,6.48 270 bottom
U$51  [A422]  50.8,6.35 270 bottom
U$52  [A523]  53.34,6.35 270 bottom
U$53  [AREF2]  13.72,49.91 270 bottom
U$54  [LED1]  8.26,37.21 270 bottom
U$55  [D0#RX17]  53.34,49.91 270 bottom
U$56  [D1#TX15]  50.8,49.91 270 bottom
U$57  [5V26]  27.94,6.35 270 bottom
U$58  [D79]  35.56,49.91 270 bottom
U$59  [D88]  31.5,49.78 270 bottom
U$60  [D97]  28.96,49.91 270 bottom
U$61  [D106]  26.42,49.91 270 bottom
U$62  [D115]  23.88,49.91 270 bottom
U$63  [D124]  21.34,49.91 270 bottom
U$64  [D133]  18.8,49.91 270 bottom
U$65  [D214]  48.26,49.91 270 bottom
U$66  [D313]  45.72,49.91 270 bottom
U$67  [D412]  43.18,49.91 270 bottom
U$68  [D511]  40.64,49.91 270 bottom
U$69  [D610]  38.1,49.91 270 bottom
U$70  [GND24]  16.26,49.91 270 bottom
U$71  [GND24]  30.48,7.37 270 bottom
U$72  [GND24]  33.02,7.37 270 bottom
U$73  [GND33]  57.66,26.92 270 bottom
U$74  [PWR0]  4.57,37.47 270 bottom
U$75  [MISO30]  51.69,32.89 270 bottom
U$76  [MOSI34]  57.66,30.1 270 bottom
U$77  [REF28]  20.32,6.99 270 bottom
U$78  [RESET32]  51.69,27.05 270 bottom
U$79  [SCK31]  51.69,29.72 270 bottom
U$80  [SCL0]  8.64,49.91 270 bottom
U$81  [SDA1]  11.18,49.91 270 bottom
U$82  [VIN27]  35.56,6.86 270 bottom
U$83  [RESET0]  42.93,8.26 90 top
U$84  [440]  35.56,40.13 90 top
U$85  [REDBOARD_TURBO1]  34.04,45.47 270 bottom
U$86  [BITMAP#JPG]  22.73,23.75 0 top
U$87  [CHG_SET1]  24.51,21.59 270 bottom
U$88  [VIN#_6V_MAX2]  4.95,1.52 0 top
Y1  46.35,26.04 180 top

### Tracks (layer width: path | path; a pad name or v marks a point on that pad's centre or on a via)
3.3V  (via drill 0.25)
  Top 0.203: U4.17 40.12,35.55 40.51,35.94 41.49,35.94 41.74,36.2 C12.1 | R11.2 49.53,19.05 52.07,21.59 v52.07,22.86 | R7.2 v6.35,33.66 | v6.35,31.11 R8.2 | R9.2 v6.35,28.57 | D7.1 33.35,42.37 32.89,41.91 31.75,41.91 | 31.75,41.91 29.59,41.91 28.74,41.06 C14.1 | 31.75,41.91 31.75,36.7 v33.4,35.05
  Top 0.254: 36.17,27.73 37.91,29.46 40.12,29.46 | R10.2 v6.35,26.04 9.27,26.04 11.18,24.13 26.67,24.13 | JP7.IOREF 20.32,4.19 20.83,4.7 25.4,4.7 | U5.7 32.38,20.83 32.13,21.08 30.48,21.08 | 30.48,21.08 29.21,21.08 | 29.21,21.08 26.67,21.08 | U5.8 31.11,21.08 30.48,21.08 | C13.1 29.21,21.08 | U5.3 33.66,11.94 32.89,11.18 26.67,11.18
  Top 0.279: U4.17 v40.12,30.73 40.12,29.46 U4.44 40.12,25.07 | 36.17,27.73 U4.36 33.91,27.73 33.87,27.73 C11.1
  Top 0.305: L1.1 48.17,29 v48.26,29.08 | 40.12,25.07 40.12,24.13 | 40.12,24.13 40.12,22.53 v38.73,21.14 | C8.1 40.12,24.13
  Top 0.406: U3.5 21.59,11.11 | C5.1 20.95,12.7 21.59,12.06 21.59,11.11 | 26.67,8.89 26.67,11.11 26.67,11.18 26.67,11.43 26.67,20.32 26.67,21.08 26.67,24.13 26.67,26.8 27.59,27.72 v28.7,27.72 v28.7,27.73 33.91,27.73 | 26.67,8.89 v40.51,8.89 | v52.07,8.89 52.07,15.62 52.46,16.01 J2.2 | JP7.3.3V 25.4,4.7 25.4,8.89 | 25.4,8.89 26.67,8.89 | 25.4,8.89 23.81,8.89 21.59,11.11
  Bottom 0.203: v52.07,22.86 52.07,26.67 52.07,32.38 | v6.35,33.66 v6.35,31.11 v6.35,28.57 v6.35,26.04 | v33.4,35.05 28.7,30.35 v28.7,27.72
  Bottom 0.254: JP7.VCC 56.02,31.61 55.24,32.38 52.07,32.38 49.4,32.38 48.26,31.24 48.26,30.61 | 48.26,30.61 v48.26,29.08 | 46.61,30.73 48.26,30.73 48.26,30.61
  Bottom 0.305: v40.12,30.73 46.61,30.73 | v38.73,21.14 JP6.1
  Bottom 0.406: v40.51,8.89 v52.07,8.89
!RESET  (via drill 0.25)
  Top 0.203: U4.40 v38.12,27.67 | JP7.RESET@2 53.48,21.35 51.44,19.3 51.44,14.61 50.8,13.97 50.67,13.97 | R11.1 v49.53,13.97 50.67,13.97 | S1.2 50.67,13.97 | v46.23,13.34 46.23,12.95 45.97,12.7 S1.1
  Bottom 0.203: 38.99,12.13 39.56,12.13 40.01,12.57 JP6.10 v46.23,13.34 48.9,13.34 v49.53,13.97 | v38.12,27.67 36.83,26.38 36.83,12.7 37.4,12.13 38.99,12.13 | JP7.RESET@1 22.99,2.41 24.51,0.89 36.45,0.89 38.99,3.43 38.99,12.13
A0  (via drill 0.25)
  Top 0.203: U4.3 42.38,28.73 v42.23,28.57 | v45.72,20.32 41.78,16.38 41.78,3.56 JP7.A0
  Bottom 0.203: v42.23,28.57 42.23,22.54 44.45,20.32 v45.72,20.32
A1
  Top 0.203: U4.7 44.41,30.73 45.25,31.57 47.65,31.57 49.2,30.02 49.2,21.92 42.29,15.01 42.29,3.56 JP7.A1
A2
  Top 0.203: U4.8 44.4,31.23 45.1,31.93 47.8,31.93 49.55,30.18 49.55,21.64 42.77,14.86 42.77,5.35 JP7.A2
A3
  Top 0.203: U4.9 44.39,31.73 44.95,32.28 47.95,32.28 49.91,30.33 49.91,21.49 43.28,14.86 43.28,5.69 44.28,4.7 47.37,4.7 48.26,3.81 JP7.A3
A4
  Top 0.203: U4.10 44.38,32.23 44.79,32.64 48.11,32.64 50.27,30.48 50.27,21.34 43.74,14.81 43.74,6.93 44.83,5.84 49.28,5.84 50.8,4.32 JP7.A4
A5  (via drill 0.25)
  Top 0.203: U4.47 41.62,27.02 41.91,27.3 42.42,27.3 v43.69,26.04 | v48.01,14.61 48.01,8.89 | 48.01,8.89 48.01,7.87 | 48.01,8.89 48.01,7.87 | 48.01,7.87 49.53,6.35 51.05,6.35 53.34,4.06 JP7.A5
  Bottom 0.203: v43.69,26.04 48.01,21.72 v48.01,14.61
AREF  (via drill 0.25)
  Top 0.203: U4.4 42.52,29.23 42.29,29.46 41.7,29.46 v41.23,29.93
  Bottom 0.203: JP7.AREF 13.72,47.24 24.38,36.58 33.78,36.58 34.67,35.69 34.67,32.64 34.92,32.38 38.48,32.38 39.24,31.62 39.24,30.1 39.41,29.93 v41.23,29.93
CHG_STAT
  Top 0.203: U1.1 20,21.91 19.05,22.86 6.99,22.86 6.35,22.23 3.43,22.23 2.96,22.69 R6.2
D0/RXI  (via drill 0.25)
  Top 0.203: U4.16 40.64,34.71 40.64,32.89 v41.91,31.62
  Bottom 0.203: v41.91,31.62 45.59,31.62 53.34,39.37 JP7.D0
D1/TXO  (via drill 0.25)
  Top 0.203: U4.15 41.12,33.68 41.86,32.94 v42.29,32.94
  Bottom 0.203: v42.29,32.94 45.01,32.94 50.8,38.73 JP7.D1
D2
  Top 0.203: U4.23 37.12,37.63 39.12,39.62 46.61,39.62 48.26,41.27 JP7.D2
D3  (via drill 0.25)
  Top 0.203: U4.14 41.62,33.82 41.78,33.66 42.32,33.66 42.55,33.88 42.55,34.8 44.2,36.45 v45.47,36.45
  Bottom 0.203: v45.47,36.45 45.72,36.7 JP7.D3
D4  (via drill 0.25)
  Top 0.203: U4.13 42.12,35.64 v44.2,37.72
  Bottom 0.203: v44.2,37.72 43.18,38.73 JP7.D4
D5
  Top 0.203: U4.24 36.62,37.89 40.64,41.91 JP7.D5
D6
  Top 0.203: U4.29 36.06,31.23 36.2,31.37 36.2,38.23 38.1,40.13 JP7.D6
D7  (via drill 0.25)
  Top 0.203: U4.30 36.57,30.73 36.96,31.11 v36.96,33.4 | v35.56,39.88 JP7.D7
  Bottom 0.203: v35.56,39.88 35.56,38.48 36.96,37.08 v36.96,33.4
D8  (via drill 0.25)
  Top 0.203: U4.11 44.38,32.73 44.93,33.29 44.93,34.85 v44.4,35.38
  Bottom 0.203: v44.4,35.38 31.5,48.28 JP7.D8
D9  (via drill 0.25)
  Top 0.203: U4.12 43.62,34.33 v43.43,34.52
  Bottom 0.203: v43.43,34.52 28.96,49 JP7.D9
D10  (via drill 0.25)
  Top 0.203: U4.27 32.92,32.23 v26.42,38.73
  Bottom 0.203: v26.42,38.73 JP7.D10
D11
  Top 0.203: U4.25 34.08,33.23 23.88,43.43 JP7.D11
D12  (via drill 0.25)
  Top 0.203: U4.28 32.28,31.73 21.34,42.67 v21.34,42.93
  Bottom 0.203: v21.34,42.93 JP7.D12
D13  (via drill 0.25)
  Top 0.203: U4.26 33.56,32.73 v33.27,33.02 18.8,47.5 JP7.D13 | v20.45,28.57 14.39,28.57 12.19,30.77 R12.2 11.39,31.41 11.19,31.61 Q2.1
  Bottom 0.203: v33.27,33.02 33.27,25.65 31.37,23.75 25.27,23.75 v20.45,28.57
FLASH_CS  (via drill 0.25)
  Top 0.203: U4.22 37.62,31.47 v37.85,31.24 | v31.11,15.11 U5.1
  Bottom 0.203: v37.85,31.24 37.85,28.07 37.64,27.87 37.64,27.86 31.11,21.34 v31.11,15.11
FLASH_MISO
  Top 0.203: U5.2 32.38,16.38 33.02,17.02 36.32,17.02 36.83,17.53 36.83,19.56 37.34,20.07 40.39,20.07 40.89,20.57 41.91,21.59 41.91,25.05 42.12,25.26 42.12,25.4 U4.48
FLASH_MOSI  (via drill 0.25)
  Top 0.203: U4.37 36.62,25.54 v35.39,24.3 | v34.92,21.59 U5.5
  Bottom 0.203: v34.92,21.59 35.64,22.3 35.64,24.1 35.43,24.3 v35.39,24.3
FLASH_SCK  (via drill 0.25)
  Top 0.203: U4.38 37.12,25.1 v35.16,23.14 | v33.91,21.84 33.66,21.59 U5.6
  Bottom 0.203: v35.16,23.14 33.91,21.89 v33.91,21.84
GND  (via drill 0.25)
  Top 0.203: C12.2 40.04,36.23 39.62,35.81 U4.18 39.62,33.52 v39.24,33.15
  Top 0.254: 46.1,28.07 48.13,28.07 v48.26,27.94 | v39.24,33.15 39.24,31.56 35.91,28.23 U4.35 27.78,28.23 v27.3,28.7 | v39.24,28.7 39.24,27.18 39.12,27.05 U4.42 39.12,25.28 38.73,24.89 C10.2 | v40.89,31.62 42.79,29.73 U4.5 44.69,29.73 44.96,29.46 44.96,29.08 44.83,28.96 44.87,29 C6.2
  Top 0.279: C6.2 45.85,28.32 46.1,28.07
  Top 0.406: 6.38,39.21 7.24,38.35
  Bottom 0.254: SJ1.1 5.08,34.92 3.56,36.45
  other vias: 30.67,26.54 43.12,22.86 46.35,22.03 37.72,21.72 12.95,41.91 29.27,24.64 18.99,40.64 19.05,10.16 11.3,36.13 10.29,40.07 32.89,21.72 36.58,29.34 28.26,14.22 34.73,15.88 28.77,39.88 27.94,44.45 47.05,7.87 7.87,28.96 10.16,26.42 17.53,24.89 11.68,29.59 43.18,37.72 36.7,45.85 39.37,44.45 42.16,44.96 42.42,40.89 49.53,41.15 46.74,45.59 52.2,41.15 54.1,38.1 52.83,36.07 52.83,34.29 50.04,34.29 47.12,37.21 33.66,48.77 22.86,46.35 14.22,37.34 7.37,37.72 9.27,36.2 7.87,33.66 10.54,34.8 44.96,7.37 44.45,5.33 50.29,7.49 52.07,46.23
  pour Top (isolate 0.305): 0,53.34 0,0 58.42,0 58.42,53.34
  pour Bottom (isolate 0.305): 0,53.34 0,0 58.42,0 58.42,53.34
LED/SWCLK  (via drill 0.25)
  Top 0.203: v40.89,27.81 40.62,27.54 U4.45 | v38.33,31.85 38.33,32.92 v38.23,33.02 | v36.2,39.12 35.31,39.12 34.04,37.85 33.53,37.85 33.35,38.02 D7.4
  Bottom 0.203: JP6.4 40.89,18.03 v40.89,27.81 40.89,28.15 41.44,28.69 41.44,29.09 41.16,29.38 39.33,29.38 38.33,30.38 v38.33,31.85 | v38.23,33.02 38.23,37.59 36.7,39.12 v36.2,39.12
N$1
  Top 0.203: J3.VBUS 7.46,41.94 7.62,41.78 F1.1
N$2
  Top 0.254: C9.2 45.09,26.02 Y1.P$2 45.1,27.29 44.66,27.73 U4.1
N$3
  Top 0.203: D4.C 7.37,32.38 7.49,32.26 Q2.3
N$4
  Top 0.254: C7.1 47.62,26.02 Y1.P$1 47.6,27.2 47.24,27.56 45.49,27.56 44.82,28.23 U4.2
N$5
  Top 0.203: D3.A 2.93,33.68 R7.1
N$6
  Top 0.203: D4.A 2.93,31.14 R8.1
N$8
  Top 0.254: D2.C 4.69,23.52 R6.1
N$10
  Top 0.203: D5.A 2.93,28.6 R9.1
N$11
  Top 0.203: D6.A 2.93,26.06 R10.1
N$12  (via drill 0.25)
  Top 0.203: D3.C 4.69,35.93 4.83,36.07 8.38,36.07 9.14,35.31 v9.14,34.92
  Bottom 0.203: v9.14,34.92 SJ1.2
N$13
  Top 0.203: U1.5 20,19.36 20.91,20.28 R3.2 R1.2
RX_LED/SWDIO  (via drill 0.25)
  Top 0.203: v40.96,28.89 41.59,28.26 41.59,27.5 41.12,27.02 U4.46 | D6.C 10.33,27.3 11.85,25.78 v19.23,25.78 | v35.43,10.79 40.64,10.79 41.02,11.18 41.02,18.16 40.77,18.41 JP6.2
  Top 0.254: 41.02,18.16 TP1.P$1
  Bottom 0.203: JP6.2 40.01,27.94 v40.96,28.89 | v35.43,10.79 30.56,10.79 29.74,11.61 29.74,20.42 28.8,21.36 23.65,21.36 v19.23,25.78
SCL
  Top 0.203: U4.32 32.5,29.73 15.9,46.33 13.11,46.33 8.64,50.8 JP7.SCL 10.41,52.7 54.1,52.7 55.37,51.44 55.37,40.13 57.91,37.59 57.91,22.48 55.12,19.68 53.72,19.68 53.34,19.3 J2.4
SDA  (via drill 0.25)
  Top 0.203: U4.31 32.76,30.23 16.13,46.86 14.99,46.86 JP7.SDA 12.7,52.2 53.98,52.2 54.86,51.31 54.86,39.12 v55.88,38.1 | v55.12,17.02 v55.11,17.01 J2.3
  Bottom 0.203: v55.88,38.1 57.4,38.1 57.91,37.59 57.91,21.21 55.12,18.41 v55.12,17.02
SPI_MISO
  Top 0.203: U4.21 38.12,37.99 39.32,39.19 48.18,39.19 51.51,35.87 51.51,32.53 JP7.MISO
SPI_MOSI
  Top 0.203: U4.19 39.12,37.85 39.75,38.48 47.88,38.48 50.8,35.56 50.8,28.07 52.2,26.67 54.8,26.67 JP7.MOSI
SPI_SCK
  Top 0.203: U4.20 38.62,37.86 39.6,38.84 48.03,38.84 51.16,35.71 51.16,30.21 JP7.SCK
TX_LED  (via drill 0.25)
  Top 0.203: v30.35,22.48 35.18,22.48 37.62,24.92 U4.39 | v20.19,27.05 12.32,27.05 9.53,29.84 D5.C
  Bottom 0.203: v30.35,22.48 26.67,22.48 24.77,22.48 v20.19,27.05
USB_D+
  Top 0.203: U4.34 29.66,28.73 20.17,38.23 9.88,38.23 7.47,40.64 J3.D+
USB_D-
  Top 0.203: U4.33 29.82,29.23 20.3,38.75 9.89,38.75 7.35,41.29 J3.D-
USB_HOST_EN  (via drill 0.25)
  Top 0.203: U4.41 38.62,27.13 38.86,27.37 38.86,28.07 38.48,28.45 37.53,28.45 34.61,25.53 30.35,25.53 v29.21,26.67 | v22.48,32.26 22.48,33.4 18.8,37.08 R2.1
  Bottom 0.203: v29.21,26.67 28.07,26.67 v22.48,32.26
USB_HOST_POWER_EN  (via drill 0.25)
  Top 0.254: U2.4 v19.18,32.07 | v13.21,39.62 13.37,39.62 R5.1 14.39,42.08 Q1.1
  Bottom 0.203: v19.18,32.07 13.65,32.07 13.21,32.51 v13.21,39.62
USB_ID
  Top 0.203: 13.97,35.56 12.46,37.07 9.41,37.07 6.49,39.99 J3.ID | 13.97,35.56 13.97,33.97 | 13.97,33.97 13.97,33.4 14.35,33.02 U2.2 | U2.1 13.97,33.97 | R4.1 13.97,35.56
  Top 0.254: R4.1 R2.2
VBAT
  Top 0.406: U1.3 18.1,21.27 17.78,21.59 16.51,21.59 | C2.1 16.51,21.59 | J1.2 7.62,20.05 7.75,20.18 8.02,20.45 9.16,21.59 13.97,21.59 | 16.51,21.59 13.97,21.59 | D1.A 13.97,21.59
VDDANA
  Top 0.279: U4.6 45.34,30.23 45.81,30.7 C6.1 L1.2
VDDCORE
  Top 0.254: U4.43 39.62,22.86 39.41,22.64 C10.1
VIN  (via drill 0.25)
  Top 0.254: R5.2 v17.78,40.64 | U2.5 18.6,33.97 18.92,34.29 v18.92,35.56 R4.2
  Top 0.406: Q1.2 17.51,42.18 17.78,41.91 v17.78,40.64 | U1.4 18.1,16.1 C4.1 16.51,16 16.13,16 | 16.13,9.21 16.13,10.16 | 16.13,10.16 16.13,11.05 | 16.13,11.05 16.13,16 | U3.3 16.51,9.21 16.13,9.21 | D1.C v13.97,16.51 14.48,16 16.13,16 | v3.81,45.72 1.27,45.72 0.64,45.09 0.64,24.77 | 0.64,24.77 D2.A | C3.1 16.51,7.49 16.13,7.87 16.13,9.21 | 0.64,24.77 0.64,19.68 v3.81,16.51 | JP3.PWR 16.13,10.16 | U3.1 16.13,11.11 16.13,11.05
  Bottom 0.254: v18.92,35.56 17.78,36.7 v17.78,40.64
  Bottom 0.406: v17.78,40.64 12.95,40.64 7.87,45.72 v3.81,45.72 | JP3.PWR 17.13,5.08 33.02,5.08 35.43,2.67 JP7.VIN | v3.81,16.51 v13.97,16.51
VUSB  (via drill 0.25)
  Top 0.406: Q1.3 13.54,44.28 13.24,44.58 C1.1 10.16,44.58 | F1.2 10.16,44.58 | v10.16,45.97 10.16,44.58 | v27.05,6.48 27.94,5.59 JP7.5V
  Bottom 0.406: v27.05,6.48 19.56,13.97 4.45,13.97 0.64,17.78 0.64,43.56 3.56,46.48 9.65,46.48 v10.16,45.97

### Text on the board
Bottom: v10
tPlace: ~ | ~ | ~ | ~ | ~ | ~ | ~ | ~ | ~ | ~ | + | -
bPlace: ~ | ~ | ~ | ~ | ~ | ~ | ~ | ~ | ~ | ~
Measures: Units in inches
tDocu: Jim Lindblom | Revised by Mike Hord